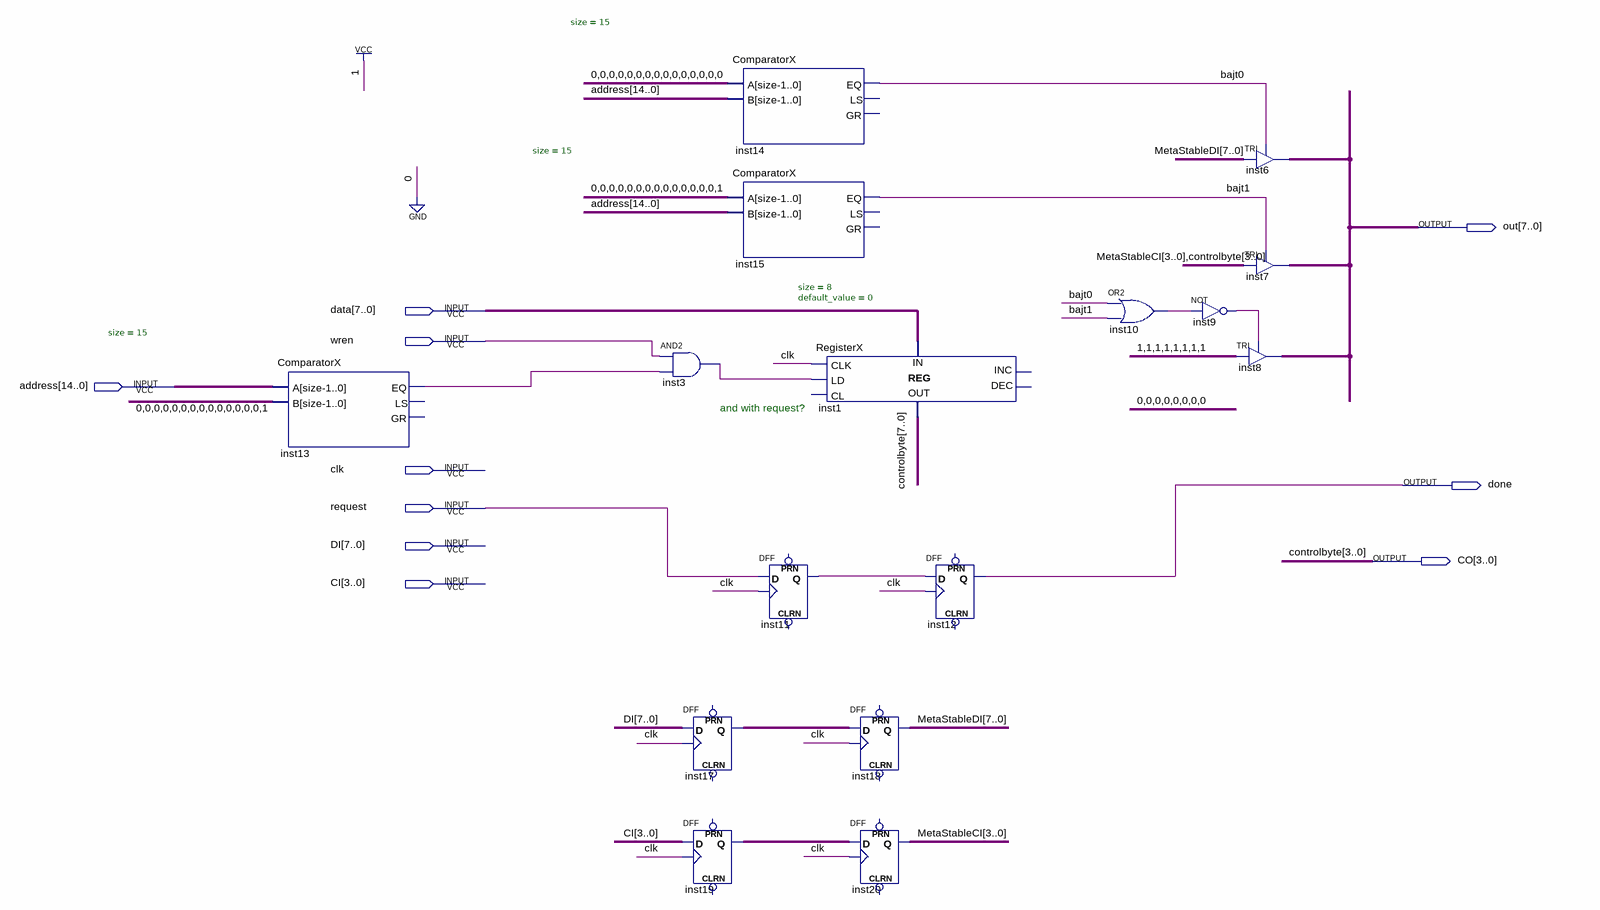
[diagram p0: schematic sheet]
// Quartus schematic GPIORAM.bdf as structural Verilog: 16 symbols, 10 pins
module GPIORAM (
  input  [7:0] data,
  input  wren,
  input  [14:0] address,
  input  clk,
  input  request,
  input  [7:0] DI,
  input  [3:0] CI,
  output [7:0] out,
  output done,
  output [3:0] CO
);

  wire bajt0, bajt1, inst3_out, inst9_out, inst10_out, inst11_q, inst13_eq;
  wire [3:0] inst19_q, MetaStableCI;
  wire [7:0] inst17_q, MetaStableDI;
  wire [7:4] controlbyte;

  ComparatorX #(.size(15)) inst13 (.A(address), .B(15'b000000000000001), .EQ(inst13_eq));  // open: LS, GR
  and inst3 (inst3_out, wren, inst13_eq);
  DFF inst17[7:0] (.CLK(clk), .D(DI), .Q(inst17_q));  // open: CLRN, PRN
  DFF inst19[3:0] (.CLK(clk), .D(CI), .Q(inst19_q));  // open: CLRN, PRN
  ComparatorX #(.size(15)) inst14 (.A({15{1'b0}}), .B(address), .EQ(bajt0));  // open: LS, GR
  ComparatorX #(.size(15)) inst15 (.A(15'b000000000000001), .B(address), .EQ(bajt1));  // open: LS, GR
  RegisterX #(.size(8), .default_value(0)) inst1 (
    .CLK(clk), .LD(inst3_out), .DATA_IN(data), .DATA_OUT({controlbyte, CO}));  // open: CL, INC, DEC
  DFF inst11 (.CLK(clk), .D(request), .Q(inst11_q));  // open: CLRN, PRN
  DFF inst18[7:0] (.CLK(clk), .D(inst17_q), .Q(MetaStableDI));  // open: CLRN, PRN
  DFF inst20[3:0] (.CLK(clk), .D(inst19_q), .Q(MetaStableCI));  // open: CLRN, PRN
  DFF inst12 (.CLK(clk), .D(inst11_q), .Q(done));  // open: CLRN, PRN
  or inst10 (inst10_out, bajt0, bajt1);
  not inst9 (inst9_out, inst10_out);
  TRI inst8[7:0] (.IN({8{1'b1}}), .OE(inst9_out), .OUT(out));
  TRI inst6[7:0] (.IN(MetaStableDI), .OE(bajt0), .OUT(out));
  TRI inst7[7:0] (.IN({MetaStableCI, CO}), .OE(bajt1), .OUT(out));

  // Other names for the same wires on the sheet: controlbyte[3:0] = CO

  // Notes on the sheet:
  //   and with request?
endmodule
